# EAGLE design SensorController (EAGLE 6.1)
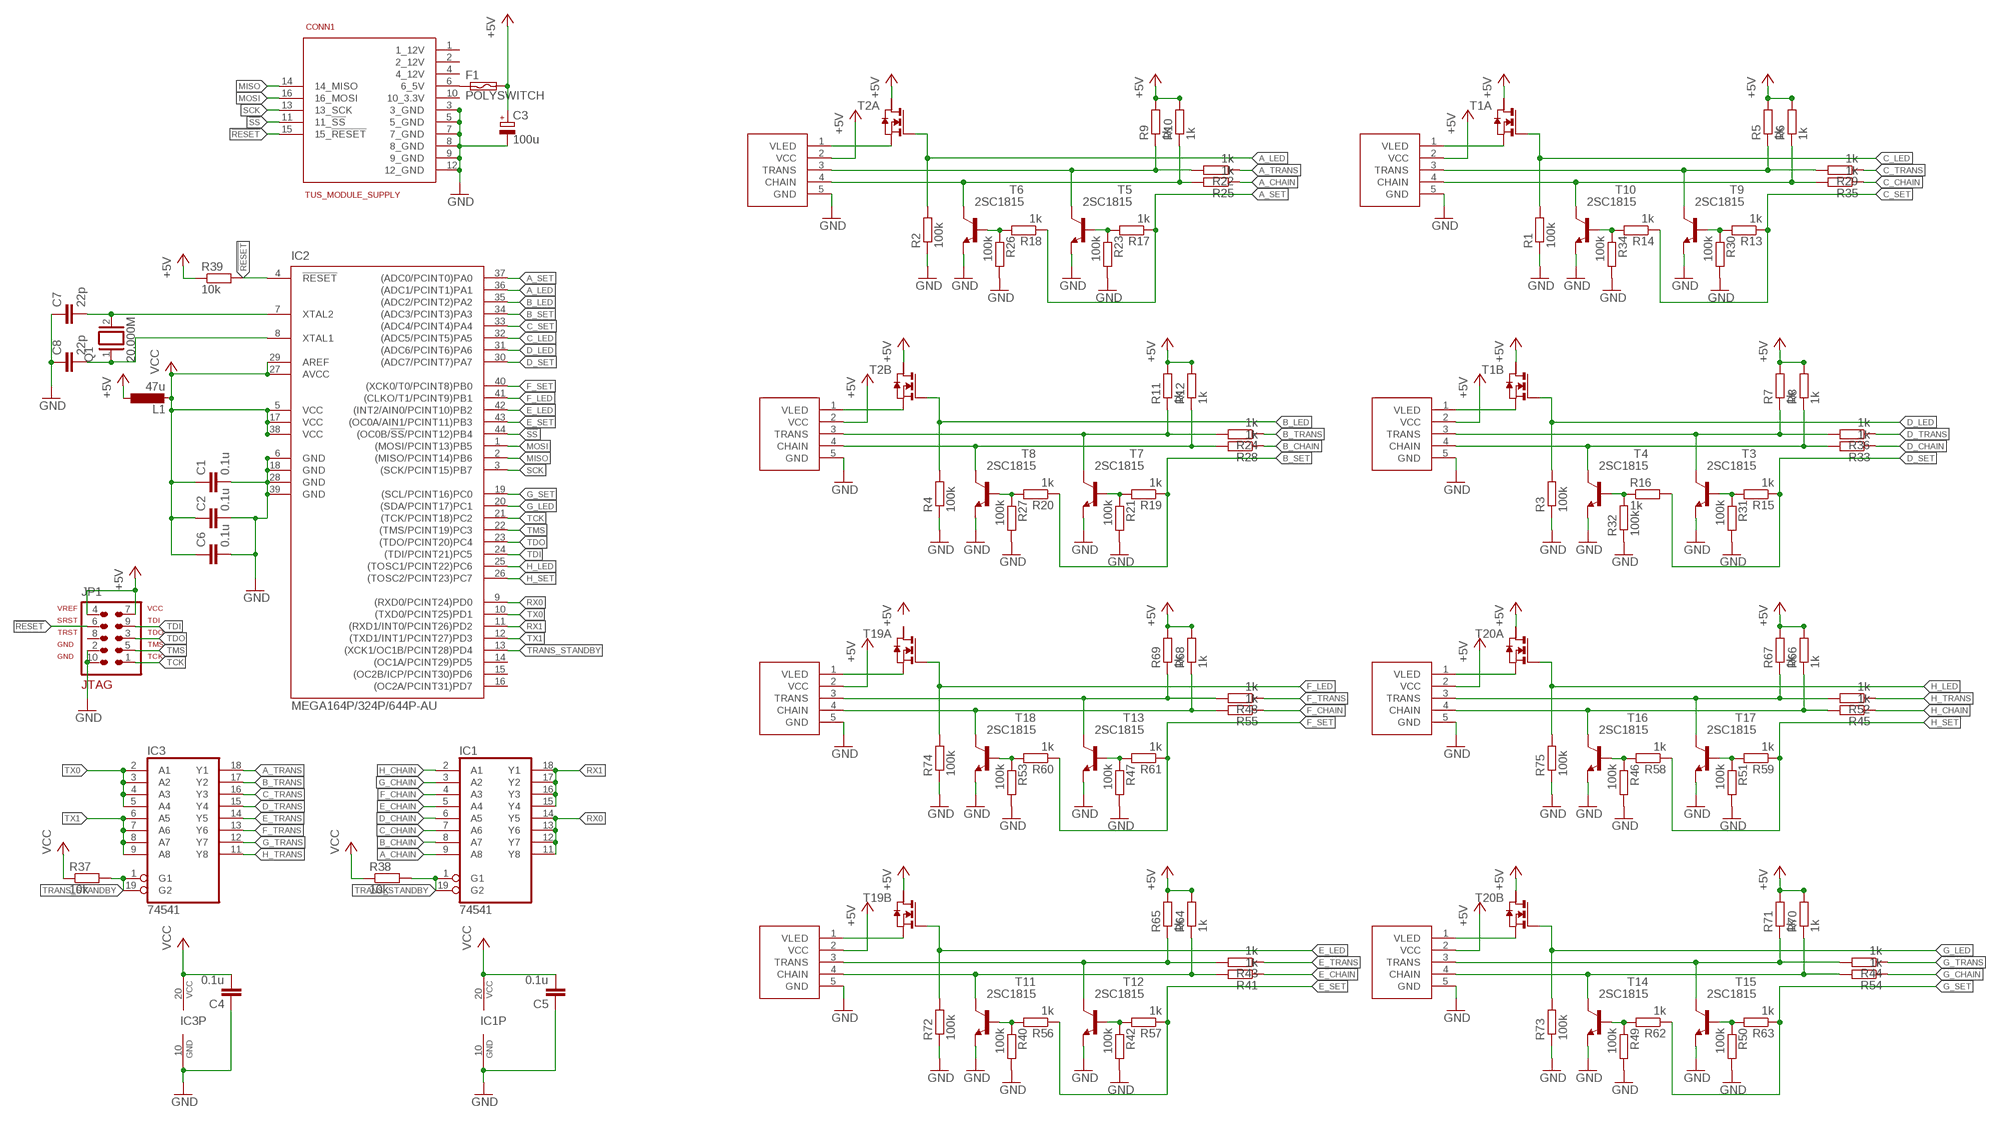
[diagram p0: schematic, sheet 1]

## Parts
A_OUT  SERIAL_SENSORXH  [XH-5]
B_OUT  SERIAL_SENSORXH  [XH-5]
C1  0.1u  C-EUC1608  [C1608]
C2  0.1u  C-EUC1608  [C1608]
C3  100u  CPOL-EUE2.5-7  [E2,5-7]
C4  0.1u  C-EUC1608  [C1608]
C5  0.1u  C-EUC1608  [C1608]
C6  0.1u  C-EUC1608  [C1608]
C7  22p  C-EUC1608  [C1608]
C8  22p  C-EUC1608  [C1608]
C_OUT  SERIAL_SENSORXH  [XH-5]
CONN1  TUS_MODULE_SUPPLY  [2X08]
D_OUT  SERIAL_SENSORXH  [XH-5]
E_OUT  SERIAL_SENSORXH  [XH-5]
F1  POLYSWITCH  [0207/2V]
F_OUT  SERIAL_SENSORXH  [XH-5]
G_OUT  SERIAL_SENSORXH  [XH-5]
H_OUT  SERIAL_SENSORXH  [XH-5]
IC1  74541  [SSOP20]
IC2  MEGA164P/324P/644P-AU  [TQFP44]
IC3  74541  [SSOP20]
JP1  AVR-JTAG-10  [AVR-JTAG-10]
L1  47u  L-EUL1812  [L1812]
Q1  20.000M  XTAL/S  [QS]
R1  100k  R-EU_R0603  [R0603]
R2  100k  R-EU_R0603  [R0603]
R3  100k  R-EU_R0603  [R0603]
R4  100k  R-EU_R0603  [R0603]
R5  1k  R-EU_R0603  [R0603]
R6  1k  R-EU_R0603  [R0603]
R7  1k  R-EU_R0603  [R0603]
R8  1k  R-EU_R0603  [R0603]
R9  1k  R-EU_R0603  [R0603]
R10  1k  R-EU_R0603  [R0603]
R11  1k  R-EU_R0603  [R0603]
R12  1k  R-EU_R0603  [R0603]
R13  1k  R-EU_R0603  [R0603]
R14  1k  R-EU_R0603  [R0603]
R15  1k  R-EU_R0603  [R0603]
R16  1k  R-EU_R0603  [R0603]
R17  1k  R-EU_R0603  [R0603]
R18  1k  R-EU_R0603  [R0603]
R19  1k  R-EU_R0603  [R0603]
R20  1k  R-EU_R0603  [R0603]
R21  100k  R-EU_R0603  [R0603]
R22  1k  R-EU_R0603  [R0603]
R23  100k  R-EU_R0603  [R0603]
R24  1k  R-EU_R0603  [R0603]
R25  1k  R-EU_R0603  [R0603]
R26  100k  R-EU_R0603  [R0603]
R27  100k  R-EU_R0603  [R0603]
R28  1k  R-EU_R0603  [R0603]
R29  1k  R-EU_R0603  [R0603]
R30  100k  R-EU_R0603  [R0603]
R31  100k  R-EU_R0603  [R0603]
R32  100k  R-EU_R0603  [R0603]
R33  1k  R-EU_R0603  [R0603]
R34  100k  R-EU_R0603  [R0603]
R35  1k  R-EU_R0603  [R0603]
R36  1k  R-EU_R0603  [R0603]
R37  10k  R-EU_R0603  [R0603]
R38  10k  R-EU_R0603  [R0603]
R39  10k  R-EU_R0603  [R0603]
R40  100k  R-EU_R0603  [R0603]
R41  1k  R-EU_R0603  [R0603]
R42  100k  R-EU_R0603  [R0603]
R43  1k  R-EU_R0603  [R0603]
R44  1k  R-EU_R0603  [R0603]
R45  1k  R-EU_R0603  [R0603]
R46  100k  R-EU_R0603  [R0603]
R47  100k  R-EU_R0603  [R0603]
R48  1k  R-EU_R0603  [R0603]
R49  100k  R-EU_R0603  [R0603]
R50  100k  R-EU_R0603  [R0603]
R51  100k  R-EU_R0603  [R0603]
R52  1k  R-EU_R0603  [R0603]
R53  100k  R-EU_R0603  [R0603]
R54  1k  R-EU_R0603  [R0603]
R55  1k  R-EU_R0603  [R0603]
R56  1k  R-EU_R0603  [R0603]
R57  1k  R-EU_R0603  [R0603]
R58  1k  R-EU_R0603  [R0603]
R59  1k  R-EU_R0603  [R0603]
R60  1k  R-EU_R0603  [R0603]
R61  1k  R-EU_R0603  [R0603]
R62  1k  R-EU_R0603  [R0603]
R63  1k  R-EU_R0603  [R0603]
R64  1k  R-EU_R0603  [R0603]
R65  1k  R-EU_R0603  [R0603]
R66  1k  R-EU_R0603  [R0603]
R67  1k  R-EU_R0603  [R0603]
R68  1k  R-EU_R0603  [R0603]
R69  1k  R-EU_R0603  [R0603]
R70  1k  R-EU_R0603  [R0603]
R71  1k  R-EU_R0603  [R0603]
R72  100k  R-EU_R0603  [R0603]
R73  100k  R-EU_R0603  [R0603]
R74  100k  R-EU_R0603  [R0603]
R75  100k  R-EU_R0603  [R0603]
T1  NMOS2SO8  [SO8]
T2  NMOS2SO8  [SO8]
T3  2SC1815  [TO92-ECB]
T4  2SC1815  [TO92-ECB]
T5  2SC1815  [TO92-ECB]
T6  2SC1815  [TO92-ECB]
T7  2SC1815  [TO92-ECB]
T8  2SC1815  [TO92-ECB]
T9  2SC1815  [TO92-ECB]
T10  2SC1815  [TO92-ECB]
T11  2SC1815  [TO92-ECB]
T12  2SC1815  [TO92-ECB]
T13  2SC1815  [TO92-ECB]
T14  2SC1815  [TO92-ECB]
T15  2SC1815  [TO92-ECB]
T16  2SC1815  [TO92-ECB]
T17  2SC1815  [TO92-ECB]
T18  2SC1815  [TO92-ECB]
T19  NMOS2SO8  [SO8]
T20  NMOS2SO8  [SO8]

## Nets
!RESET: CONN1.15(15_!RESET) IC2.4(!RESET) JP1.6 R39.2
!SS: CONN1.11(11_!SS) IC2.44((OC0B/!SS!/PCINT12)PB4)
+5V [+5v]: A_OUT.2(VCC) B_OUT.2(VCC) C3.+ C_OUT.2(VCC) D_OUT.2(VCC) E_OUT.2(VCC) F1.2 F_OUT.2(VCC) G_OUT.2(VCC) H_OUT.2(VCC) JP1.4 JP1.7 L1.1 R5.2 R6.2 R7.2 R8.2 R9.2 R10.2 R11.2 R12.2 R39.1 R64.2 R65.2 R66.2 R67.2 R68.2 R69.2 R70.2 R71.2 T1.6(B:D) T1.8(A:D) T2.6(B:D) T2.8(A:D) T19.6(B:D) T20.6(B:D) T20.8(A:D)
A_CHAIN: IC1.9(A8) R25.1
A_LED: IC2.36((ADC1/PCINT1)PA1) R2.2 T2.2(A:G)
A_SET: IC2.37((ADC0/PCINT0)PA0) R17.1 R18.1
A_TRANS: IC3.18(Y1) R22.1
B_CHAIN: IC1.8(A7) R28.1
B_LED: IC2.35((ADC2/PCINT2)PA2) R4.2 T2.4(B:G)
B_SET: IC2.34((ADC3/PCINT3)PA3) R19.1 R20.1
B_TRANS: IC3.17(Y2) R24.1
C_CHAIN: IC1.7(A6) R35.1
C_LED: IC2.32((ADC5/PCINT5)PA5) R1.2 T1.2(A:G)
C_SET: IC2.33((ADC4/PCINT4)PA4) R13.1 R14.1
C_TRANS: IC3.16(Y3) R29.1
D_CHAIN: IC1.6(A5) R33.1
D_LED: IC2.31((ADC6/PCINT6)PA6) R3.2 T1.4(B:G)
D_SET: IC2.30((ADC7/PCINT7)PA7) R15.1 R16.2
D_TRANS: IC3.15(Y4) R36.1
E_CHAIN: IC1.5(A4) R41.1
E_LED: IC2.42((INT2/AIN0/PCINT10)PB2) R72.2 T19.4(B:G)
E_SET: IC2.43((OC0A/AIN1/PCINT11)PB3) R56.1 R57.1
E_TRANS: IC3.14(Y5) R43.1
F_CHAIN: IC1.4(A3) R55.1
F_LED: IC2.41((CLKO/T1/PCINT9)PB1) R74.2 T19.2(A:G)
F_SET: IC2.40((XCK0/T0/PCINT8)PB0) R60.1 R61.1
F_TRANS: IC3.13(Y6) R48.1
G_CHAIN: IC1.3(A2) R54.1
G_LED: IC2.20((SDA/PCINT17)PC1) R73.2 T20.4(B:G)
G_SET: IC2.19((SCL/PCINT16)PC0) R62.1 R63.1
G_TRANS: IC3.12(Y7) R44.1
GND: A_OUT.5(GND) B_OUT.5(GND) C1.2 C2.2 C3.- C4.1 C5.1 C6.2 C7.1 C8.1 C_OUT.5(GND) CONN1.3(3_GND) CONN1.5(5_GND) CONN1.7(7_GND) CONN1.8(8_GND) CONN1.9(9_GND) CONN1.12(12_GND) D_OUT.5(GND) E_OUT.5(GND) F_OUT.5(GND) G_OUT.5(GND) H_OUT.5(GND) IC1.10(GND) IC2.6(GND) IC2.18(GND) IC2.28(GND) IC2.39(GND) IC3.10(GND) JP1.2 JP1.10 R1.1 R2.1 R3.1 R4.1 R21.2 R23.2 R26.2 R27.2 R30.2 R31.2 R32.1 R34.2 R40.2 R42.2 R46.2 R47.2 R49.2 R50.2 R51.2 R53.2 R72.1 R73.1 R74.1 R75.1 T3.E T4.E T5.E T6.E T7.E T8.E T9.E T10.E T11.E T12.E T13.E T14.E T15.E T16.E T17.E T18.E
H_CHAIN: IC1.2(A1) R45.1
H_LED: IC2.25((TOSC1/PCINT22)PC6) R75.2 T20.2(A:G)
H_SET: IC2.26((TOSC2/PCINT23)PC7) R58.1 R59.1
H_TRANS: IC3.11(Y8) R52.1
MISO: CONN1.14(14_MISO) IC2.2((MISO/PCINT14)PB6)
MOSI: CONN1.16(16_MOSI) IC2.1((MOSI/PCINT13)PB5)
N$1 [led]: A_OUT.1(VLED) T2.1(A:S)
N$2: C8.2 IC2.8(XTAL1) Q1.1
N$3: R17.2 R23.1 T5.B
N$4: C7.2 IC2.7(XTAL2) Q1.2
N$5: R18.2 R26.1 T6.B
N$6 [led]: B_OUT.1(VLED) T2.3(B:S)
N$7: R19.2 R21.1 T7.B
N$8: R20.2 R27.1 T8.B
N$9 [led]: F_OUT.1(VLED) T19.1(A:S)
N$10: R47.1 R61.2 T13.B
N$11: R53.1 R60.2 T18.B
N$12 [led]: E_OUT.1(VLED) T19.3(B:S)
N$13: R42.1 R57.2 T12.B
N$14: R40.1 R56.2 T11.B
N$15 [led]: C_OUT.1(VLED) T1.1(A:S)
N$16: R13.2 R30.1 T9.B
N$17: R14.2 R34.1 T10.B
N$18 [led]: D_OUT.1(VLED) T1.3(B:S)
N$19: R15.2 R31.1 T3.B
N$20: R16.1 R32.2 T4.B
N$21 [led]: H_OUT.1(VLED) T20.1(A:S)
N$22: R51.1 R59.2 T17.B
N$23: R46.1 R58.2 T16.B
N$24 [led]: G_OUT.1(VLED) T20.3(B:S)
N$25: R50.1 R63.2 T15.B
N$26: R49.1 R62.2 T14.B
N$27 [+5v]: CONN1.6(6_5V) F1.1
N$28: A_OUT.3(TRANS) R9.1 R22.2 T5.C
N$29: B_OUT.3(TRANS) R11.1 R24.2 T7.C
N$30: C_OUT.3(TRANS) R5.1 R29.2 T9.C
N$31: D_OUT.3(TRANS) R7.1 R36.2 T3.C
N$32: F_OUT.3(TRANS) R48.2 R69.1 T13.C
N$33: H_OUT.3(TRANS) R52.2 R67.1 T17.C
N$34: E_OUT.3(TRANS) R43.2 R65.1 T12.C
N$35: G_OUT.3(TRANS) R44.2 R71.1 T15.C
N$50: A_OUT.4(CHAIN) R10.1 R25.2 T6.C
N$51: B_OUT.4(CHAIN) R12.1 R28.2 T8.C
N$52: F_OUT.4(CHAIN) R55.2 R68.1 T18.C
N$53: E_OUT.4(CHAIN) R41.2 R64.1 T11.C
N$54: D_OUT.4(CHAIN) R8.1 R33.2 T4.C
N$55: C_OUT.4(CHAIN) R6.1 R35.2 T10.C
N$56: H_OUT.4(CHAIN) R45.2 R66.1 T16.C
N$60: G_OUT.4(CHAIN) R54.2 R70.1 T14.C
RX0: IC1.11(Y8) IC1.12(Y7) IC1.13(Y6) IC1.14(Y5) IC2.9((RXD0/PCINT24)PD0)
RX1: IC1.15(Y4) IC1.16(Y3) IC1.17(Y2) IC1.18(Y1) IC2.11((RXD1/INT0/PCINT26)PD2)
SCK: CONN1.13(13_SCK) IC2.3((SCK/PCINT15)PB7)
TCK: IC2.21((TCK/PCINT18)PC2) JP1.1
TDI: IC2.24((TDI/PCINT21)PC5) JP1.9
TDO: IC2.23((TDO/PCINT20)PC4) JP1.3
TMS: IC2.22((TMS/PCINT19)PC3) JP1.5
TRANS_STANDBY: IC1.1(G1) IC1.19(G2) IC2.13((XCK1/OC1B/PCINT28)PD4) IC3.1(G1) IC3.19(G2) R37.2 R38.2
TX0: IC2.10((TXD0/PCINT25)PD1) IC3.2(A1) IC3.3(A2) IC3.4(A3) IC3.5(A4)
TX1: IC2.12((TXD1/INT1/PCINT27)PD3) IC3.6(A5) IC3.7(A6) IC3.8(A7) IC3.9(A8)
VCC: C1.1 C2.1 C4.2 C5.2 C6.1 IC1.20(VCC) IC2.5(VCC) IC2.17(VCC) IC2.27(AVCC) IC2.29(AREF) IC2.38(VCC) IC3.20(VCC) L1.2 R37.1 R38.1
Unconnected: CONN1.1(1_12V) CONN1.2(2_12V) CONN1.4(4_12V) CONN1.10(10_3.3V) IC2.14((OC1A/PCINT29)PD5) IC2.15((OC2B/ICP/PCINT30)PD6) IC2.16((OC2A/PCINT31)PD7) JP1.8 T1.5(B:D2) T1.7(A:D2) T2.5(B:D2) T2.7(A:D2) T19.5(B:D2) T19.7(A:D2) T19.8(A:D) T20.5(B:D2) T20.7(A:D2)

## Library data of the parts
A_OUT B_OUT C_OUT D_OUT E_OUT F_OUT G_OUT H_OUT = myparts:SERIAL_SENSOR
C1 C2 C4-C8 = rcl:C-EU: CAPACITOR, European symbol
C3 = rcl:CPOL-EU: POLARIZED CAPACITOR, European symbol
CONN1 = tus:TUS_MODULE_SUPPLY
F1 = myparts:POLYSWITCH
IC1 IC3 = myparts:74*541: Octal BUFFER and LINE DRIVER, 3-state
IC2 = avr-7:MEGA164P/324P/644P-AU
JP1 = avr-7:AVR-JTAG-10: AVR JTAG Debug/Programming Header
L1 = resistor:L-EU: INDUCTOR, European symbol
Q1 = special:XTAL/S: CRYSTAL
R1-R13 R15-R33 R35-R75 = rcl:R-EU_: RESISTOR, European symbol
R14 R34 = resistor:R-EU_: RESISTOR, European symbol
T1 T2 T19 T20 = zetex:NMOS2: Dual MOS FET; OC_FARNELL: unknown; OC_NEWARK: unknown
T3-T18 = myparts:2SC1815: NPN EPITAXIAL TRANSISTOR Source: TOSHIBA .. 2SC1815 1.pdf

## Net classes
1 +5v: width 0.762 mm
2 led: width 0.508 mm

## Board
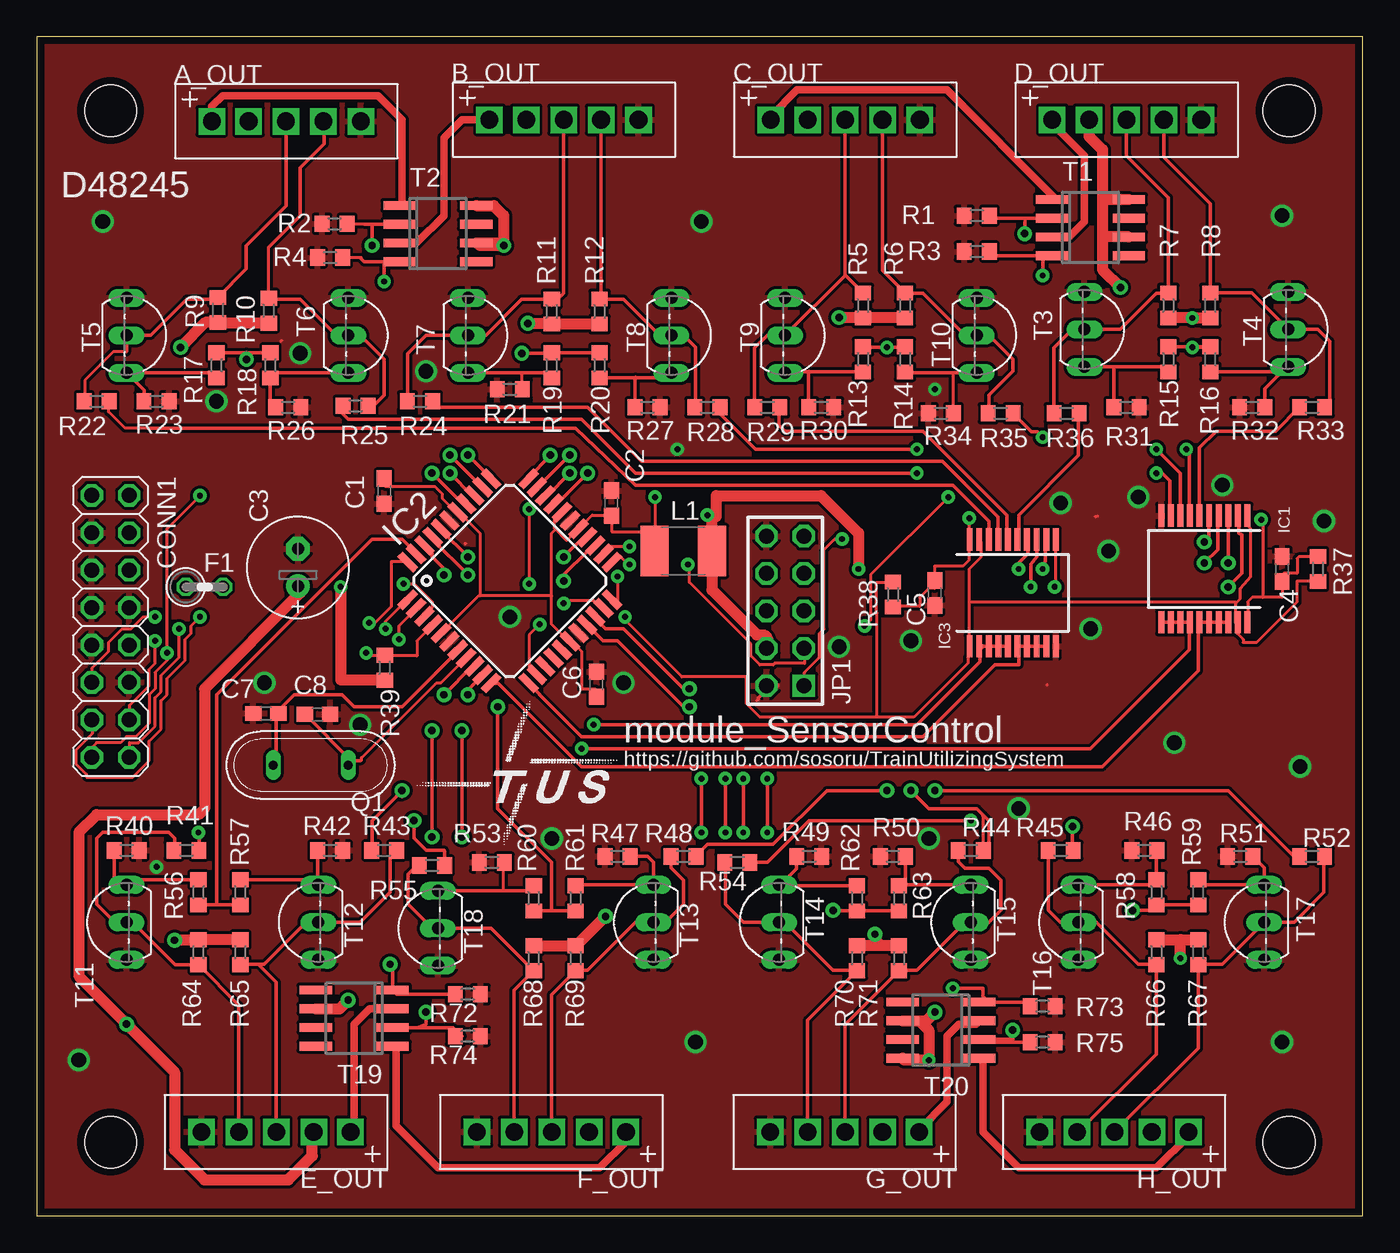
[diagram p1: board, top side]
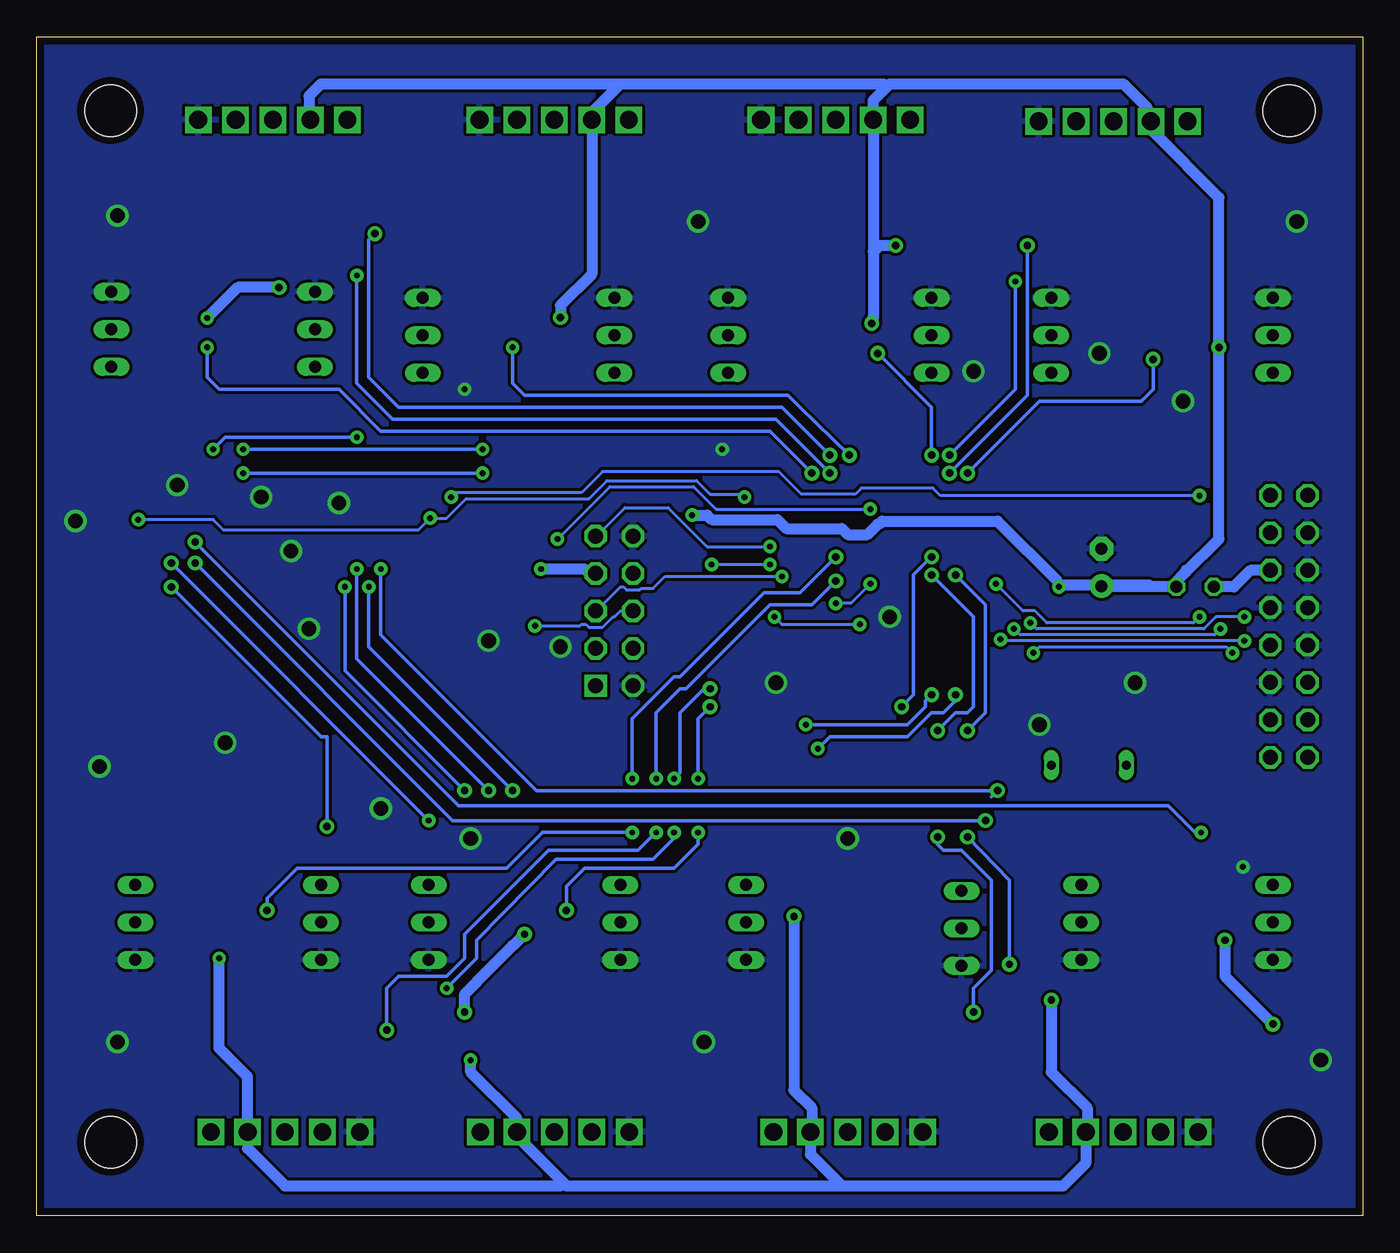
[diagram p2: board, bottom side, seen from below]

Size 90 x 80 mm. Coordinates in mm from the lower left corner, seen from the top.
Outline: 0,0 90,0 90,80 0,80 0,0
Copper layers (1*16): Top 0.035mm / dielectric 1.5mm / Bottom 0.035mm
Design rules: minimum track width 8mil, minimum drill 0.4mm, track to track 8mil, track to pad 8mil, pad to pad 8mil, via to via 8mil, smd to smd 8mil, copper to edge 20mil, drill to drill 8mil, minimum pad ring 8mil, minimum via ring 10mil, stop-mask expansion 3mil, vias tented up to drill 0mil, thermal gap 8mil
Holes 3.5 mm at 5,5 5,75 85,75 85,5

### Footprints (pad centres in the part's own frame; a part is rotated, then mirrored left to right if it is on the bottom)
XH-5 = drill 1.2 square: 1 -5.04,0; 2 -2.54,0; 3 0,0; 4 2.54,0; 5 5.08,0
C1608 = smd 1.1 x 1: 1 -0.85,0; 2 0.85,0
E2,5-7 = drill 0.813 pad 1.6: + -1.27,0 | drill 0.813 pad 1.6 octagon: - 1.27,0
2X08 = drill 1.016 octagon: 1 -8.89,-1.27; 2 -8.89,1.27; 3 -6.35,-1.27; 4 -6.35,1.27; 5 -3.81,-1.27; 6 -3.81,1.27; 7 -1.27,-1.27; 8 -1.27,1.27; 9 1.27,-1.27; 10 1.27,1.27; 11 3.81,-1.27; 12 3.81,1.27; 13 6.35,-1.27; 14 6.35,1.27; 15 8.89,-1.27; 16 8.89,1.27
0207/2V = drill 0.813 octagon: 1 -1.27,0; 2 1.27,0
SSOP20 = smd 0.4 x 1.5: 1 -2.925,-3.625; 2 -2.275,-3.625; 3 -1.625,-3.625; 4 -0.975,-3.625; 5 -0.325,-3.625; 6 0.325,-3.625; 7 0.975,-3.625; 8 1.625,-3.625; 9 2.275,-3.625; 10 2.925,-3.625; 11 2.925,3.625; 12 2.275,3.625; 13 1.625,3.625; 14 0.975,3.625; 15 0.325,3.625; 16 -0.325,3.625; 17 -0.975,3.625; 18 -1.625,3.625; 19 -2.275,3.625; 20 -2.925,3.625
TQFP44 = smd 1.5 x 0.5: 1 -5.8,4; 2 -5.8,3.2; 3 -5.8,2.4; 4 -5.8,1.6; 5 -5.8,0.8; 6 -5.8,0; 7 -5.8,-0.8; 8 -5.8,-1.6; 9 -5.8,-2.4; 10 -5.8,-3.2; 11 -5.8,-4; 23 5.8,-4; 24 5.8,-3.2; 25 5.8,-2.4; 26 5.8,-1.6; 27 5.8,-0.8; 28 5.8,0; 29 5.8,0.8; 30 5.8,1.6; 31 5.8,2.4; 32 5.8,3.2; 33 5.8,4 | smd 0.5 x 1.5: 12 -4,-5.8; 13 -3.2,-5.8; 14 -2.4,-5.8; 15 -1.6,-5.8; 16 -0.8,-5.8; 17 0,-5.8; 18 0.8,-5.8; 19 1.6,-5.8; 20 2.4,-5.8; 21 3.2,-5.8; 22 4,-5.8; 34 4,5.8; 35 3.2,5.8; 36 2.4,5.8; 37 1.6,5.8; 38 0.8,5.8; 39 0,5.8; 40 -0.8,5.8; 41 -1.6,5.8; 42 -2.4,5.8; 43 -3.2,5.8; 44 -4,5.8
AVR-JTAG-10 = drill 1.016 square: 1 -5.08,-1.27 | drill 1.016 octagon: 2 -5.08,1.27; 3 -2.54,-1.27; 4 -2.54,1.27; 5 0,-1.27; 6 0,1.27; 7 2.54,-1.27; 8 2.54,1.27; 9 5.08,-1.27; 10 5.08,1.27
L1812 = smd 1.9 x 3.4: 1 -1.95,0; 2 1.95,0
QS = drill 0.61 long: 1 -2.54,0; 2 2.54,0
R0603 = smd 1 x 1.1: 1 -0.85,0; 2 0.85,0
SO8 = smd 0.6 x 2.2: 1 -1.905,-2.6; 2 -0.635,-2.6; 3 0.635,-2.6; 4 1.905,-2.6; 5 1.905,2.6; 6 0.635,2.6; 7 -0.635,2.6; 8 -1.905,2.6
TO92-ECB = drill 0.813 long: B 2.54,0; C 0,0; E -2.54,0

### Placement (x,y rotation side)
A_OUT  16.92,74.27 0 top
B_OUT  35.76,74.37 0 top
C1  23.57,49.17 270 top
C2  39.01,48.36 90 top
C3  17.73,43.99 90 top
C4  84.53,43.89 270 top
C5  60.96,42.27 90 top
C6  38,36.07 90 top
C7  15.54,34.09 0 top
C8  19.05,34.04 180 top
C_OUT  54.86,74.37 0 top
CONN1  5,40 270 top
D_OUT  73.96,74.37 0 top
E_OUT  16.26,5.69 180 top
F1  11.38,42.67 0 top
F_OUT  34.95,5.69 180 top
G_OUT  54.86,5.69 180 top
H_OUT  73.15,5.69 180 top
IC1  79.25,43.89 180 top
IC2  32.11,43.08 45 top
IC3  66.24,42.27 0 top
JP1  50.8,41.05 90 top
L1  43.89,45.11 180 top
Q1  18.59,30.58 180 top
R1  63.8,67.87 0 top
R2  20.22,67.31 0 top
R3  63.8,65.43 0 top
R4  19.91,65.02 0 top
R5  56.08,61.77 270 top
R6  58.93,61.77 270 top
R7  76.81,61.77 270 top
R8  79.65,61.77 270 top
R9  12.29,61.47 270 top
R10  15.75,61.42 270 top
R11  34.95,61.37 270 top
R12  38.2,61.37 270 top
R13  56.08,58.12 270 top
R14  58.93,58.12 270 top
R15  76.81,58.12 270 top
R16  79.65,58.12 90 top
R17  12.19,57.71 270 top
R18  15.85,57.71 270 top
R19  34.95,57.71 270 top
R20  38.2,57.71 270 top
R21  32.11,56.08 180 top
R22  4.06,55.27 180 top
R23  8.13,55.27 0 top
R24  26.01,55.27 180 top
R25  21.64,54.97 0 top
R26  17.07,54.86 0 top
R27  41.45,54.86 0 top
R28  45.52,54.86 180 top
R29  49.58,54.86 180 top
R30  53.24,54.86 0 top
R31  73.96,54.86 0 top
R32  82.5,54.86 0 top
R33  86.56,54.86 0 top
R34  61.37,54.46 180 top
R35  65.43,54.46 180 top
R36  69.9,54.46 180 top
R37  86.97,43.89 270 top
R38  58.12,42.16 90 top
R39  23.62,37.19 90 top
R40  6.1,24.79 0 top
R41  10.16,24.79 180 top
R42  19.91,24.79 0 top
R43  23.57,24.79 0 top
R44  63.4,24.79 180 top
R45  69.49,24.79 180 top
R46  75.18,24.79 180 top
R47  39.42,24.38 180 top
R48  43.89,24.38 180 top
R49  52.43,24.38 0 top
R50  58.12,24.38 180 top
R51  81.69,24.38 180 top
R52  86.56,24.38 0 top
R53  30.89,23.98 180 top
R54  47.55,23.98 180 top
R55  26.82,23.77 180 top
R56  10.97,21.95 90 top
R57  13.82,21.95 90 top
R58  76,21.95 90 top
R59  78.84,21.95 90 top
R60  33.73,21.54 90 top
R61  36.58,21.54 90 top
R62  55.68,21.54 90 top
R63  58.52,21.54 90 top
R64  10.97,17.88 90 top
R65  13.82,17.88 90 top
R66  76,17.88 90 top
R67  78.84,17.88 90 top
R68  33.73,17.48 90 top
R69  36.58,17.48 90 top
R70  55.68,17.48 90 top
R71  58.52,17.48 90 top
R72  29.26,15.04 180 top
R73  68.28,14.22 180 top
R74  29.26,12.19 180 top
R75  68.28,11.79 180 top
T1  71.53,67.06 270 top
T2  27.23,66.65 270 top
T3  71.12,60.15 270 top
T4  84.94,60.15 270 top
T5  6.1,59.74 270 top
T6  21.13,59.74 270 top
T7  29.26,59.74 270 top
T8  43.08,59.74 270 top
T9  50.8,59.74 270 top
T10  63.8,59.74 270 top
T11  6.1,19.91 90 top
T12  19.1,19.91 90 top
T13  41.86,19.91 90 top
T14  50.39,19.91 90 top
T15  63.4,19.91 90 top
T16  70.71,19.91 90 top
T17  83.31,19.91 90 top
T18  27.23,19.51 90 top
T19  21.54,13.41 90 top
T20  61.37,12.6 90 top

### Tracks (layer width: path | path; a pad name or v marks a point on that pad's centre or on a via)
!RESET  (via drill 0.4)
  Top 0.203: IC2.4 26.82,40.03 25.81,39.01 25.81,38 23.67,38 R39.2 23.57,38 22.45,38 22.35,38.1 v22.35,38.2 | v56.19,40.03 56.59,40.44 56.59,43.48 v61.87,48.77 | v11.07,48.87 8.84,46.63 v8.84,38.2 8.84,37.69 8.03,36.88 8.03,35.76 7.62,35.36 7.62,33.43 6.71,32.51 6.1,32.51 5.69,32.11 4.06,32.11 3.76,31.8 3.76,31.19 CONN1.15
  Bottom 0.203: v8.84,38.2 9.25,38.61 21.95,38.61 v22.35,38.2 | JP1.6 50.39,41.05 50.8,40.64 50.9,40.64 51.61,39.93 52.53,39.93 52.73,40.13 53.03,40.13 53.14,40.03 v56.19,40.03 | v61.87,48.77 61.57,49.07 53.03,49.07 51.61,50.49 39.62,50.49 38.1,48.97 34.44,48.97 34.04,49.38 29.16,49.38 28.65,48.87 v11.07,48.87
!SS  (via drill 0.4)
  Top 0.203: v22.55,40.23 22.96,40.23 24.08,41.35 24.08,44.4 25.09,44.4 IC2.44 | v8.03,40.64 7.21,40.64 6.4,39.83 5.79,39.83 4.88,38.91 4.88,38.3 3.76,37.19 3.76,36.27 CONN1.11
  Bottom 0.203: v22.55,40.23 22.15,39.83 10.77,39.83 9.96,40.64 v8.03,40.64
+5V  (via drill 0.4, 0.5)
  Top 0.762: v54.46,60.96 56.08,60.96 | 56.08,60.96 58.93,60.96 R6.2 | R8.2 v78.44,60.92 R7.2 | v9.75,58.93 11.44,60.62 R9.2 12.19,60.55 12.21,60.57 R10.2 | v33.33,60.55 34.58,60.55 R11.2 38.16,60.52 38.2,60.55 R12.2 | T2.8 31.01,68.56 31.7,67.87 31.7,66.24 31.47,66.02 | 31.47,66.02 v31.7,65.84 30.07,65.84 | T2.6 31.47,66.02 | 10.97,18.69 v9.35,18.69 | T19.6 20.55,14.05 v21.13,14.63 | v38.61,20.32 36.61,18.32 R69.2 36.27,18.39 36.27,18.32 | T20.8 58.89,10.57 v60.55,10.57 60.55,12.6 59.92,13.23 T20.6 60.38,13.23 v60.96,13.82 | R71.2 57.3,18.32 | 57.3,18.32 R70.2 | v56.9,19.1 56.9,18.73 57.3,18.32 | D_OUT.2 71.42,73.25 72.34,72.34 72.34,68.68 | 72.34,68.68 72.34,66.24 | 72.34,66.24 72.34,64.21 v73.56,62.99 | T1.6 72.52,66.42 72.34,66.24 | T1.8 72.62,68.96 72.34,68.68 | v20.62,42.67 20.62,36.37 23.57,36.37 R39.1 | JP1.4 49.58,38.51 49.58,39.22 49.38,39.42 48.87,39.42 45.82,42.47 45.82,45.11 L1.1 45.82,45.41 45.82,47.24 | 45.82,47.24 v45.52,47.55 | R68.2 36.27,18.32 | 36.27,18.32 36.54,18.32 36.58,18.29 | R66.2 77.62,18.73 | 77.62,18.73 R67.2 | v77.62,17.48 77.62,18.73 | R65.2 11.01,18.73 10.97,18.69 | 10.97,18.69 R64.2 | 56.08,60.96 R5.2 | E_OUT.2 18.69,5.59 18.69,4.06 17.07,2.44 11.38,2.44 9.35,4.47 9.35,9.75 v6.1,13.01 2.85,16.26 2.85,26.01 4.06,27.23 10.97,27.23 11.38,27.64 11.38,35.76 17.88,42.27 17.88,42.57 C3.+ | v55.78,43.89 55.78,46.33 53.24,48.87 46.13,48.87 46.13,47.45 45.82,47.24
  Bottom 0.762: 12.85,42.82 12.95,42.72 C3.+ 14.43,42.77 20.52,42.77 v20.62,42.67 20.73,43.08 24.79,47.14 32.61,47.14 32.82,46.94 32.92,46.94 33.63,46.23 34.95,46.23 35.36,46.63 39.12,46.63 39.73,47.24 44.2,47.24 44.5,47.55 v45.52,47.55 | 12.85,42.82 11.99,43.69 | 11.99,43.69 9.75,45.92 v9.75,58.93 9.75,69.09 14.22,73.56 14.22,74.12 A_OUT.2 14.63,74.52 14.63,75.18 16.26,76.81 32.11,76.81 32.31,76.61 | 32.31,76.61 33.22,75.69 B_OUT.2 33.22,65.43 | 50.39,76.81 52.32,74.88 C_OUT.2 52.32,63.91 54.46,61.77 v54.46,60.96 | 50.39,76.81 32.51,76.81 32.31,76.61 | 71.42,74.47 D_OUT.2 71.53,74.37 71.53,76 70.71,76.81 50.39,76.81 | 33.22,65.43 33.22,61.06 v33.33,60.55 | v31.7,65.84 32.82,65.84 33.22,65.43 | 35.36,2.03 37.49,4.17 F_OUT.2 37.39,5.79 37.39,7.32 38.61,8.53 v38.61,20.32 | 35.36,2.03 20.32,2.03 18.8,3.56 E_OUT.2 18.69,5.79 18.69,7.32 21.13,9.75 v21.13,14.63 | 54.25,2.23 57.4,5.38 G_OUT.2 57.4,6.6 60.55,9.75 v60.55,10.57 | 54.25,2.23 54.05,2.03 35.36,2.03 | 54.25,2.23 54.46,2.03 73.15,2.03 75.69,4.57 H_OUT.2 75.69,9.45 77.62,11.38 v77.62,17.48 | v9.35,18.69 9.35,16.26 v6.1,13.01 | v60.96,13.82 60.96,15.04 60.15,15.85 60.15,15.89 57.71,18.32 57.67,18.32 v56.9,19.1 | v73.56,62.99 76.37,62.99 v78.44,60.92 | 11.99,43.81 11.99,43.69 | JP1.7 52.53,43.59 52.83,43.89 v55.78,43.89 | F1.2 12.7,42.67 12.85,42.82
A_CHAIN  (via drill 0.4)
  Top 0.203: R25.1 20.73,54.97 20.73,54.86
  Top 0.254: v59.74,50.39 40.64,50.39 36.98,54.05 21.13,54.05 20.73,54.46 20.73,54.86 | v76,50.39 76.4,50.39 76.91,49.89 76.91,47.58 IC1.9
  Bottom 0.254: v59.74,50.39 v76,50.39
A_LED  (via drill 0.5)
  Top 0.203: 22.86,67.28 22.86,67.26 22.76,67.26
  Top 0.254: IC2.36 29.56,48.88 v28.04,50.39 | v22.76,65.84 22.76,67.26 | T2.2 22.86,67.28 22.26,67.28 R2.2
  Bottom 0.254: v28.04,50.39 22.76,55.68 v22.76,65.84
A_SET  (via drill 0.5)
  Top 0.203: 14.22,58.62 14.22,58.56 14.22,58.52
  Top 0.254: R17.1 14.22,58.56 R18.1 | IC2.37 28.91,48.31 v26.82,50.39 | v14.22,58.12 14.22,58.52
  Bottom 0.254: v26.82,50.39 21.95,55.27 15.04,55.27 14.22,56.08 v14.22,58.12
A_TRANS
  Top 0.203: 7.52,53.44 5.99,53.44 4.88,54.56 4.88,55.27 R22.1 | 64.62,45.92 IC3.18
  Top 0.254: 7.52,53.44 36.58,53.44 40.64,49.58 62.18,49.58 64.62,47.14 64.62,45.92
B_CHAIN  (via drill 0.4)
  Top 0.203: 46.43,54.86 R28.1 46.33,54.86
  Top 0.254: v59.74,52.02 48.77,52.02 46.33,54.46 46.33,54.86 | v76,52.02 77.62,50.39 IC1.8
  Bottom 0.254: v59.74,52.02 v76,52.02
B_LED  (via drill 0.4, 0.5)
  Top 0.203: R4.2 22.05,65.02 22,64.97 | T2.4 23.57,64.72 23.57,64.62
  Top 0.254: T2.4 22.23,64.75 22,64.97 21.95,65.02 | IC2.35 30.21,49.44 v28.04,51.61 | v23.57,63.4 23.57,64.62
  Bottom 0.254: v28.04,51.61 23.57,56.08 v23.57,63.4
B_SET  (via drill 0.5)
  Top 0.203: 34.95,58.52 R19.1
  Top 0.254: R20.1 R19.1 | IC2.34 30.83,50.04 v29.26,51.61 | v32.92,58.52 34.95,58.52
  Bottom 0.254: v29.26,51.61 29.26,54.86 v32.92,58.52
B_TRANS
  Top 0.203: 65.33,46.33 65.33,45.92 IC3.17 65.33,46.33 | 65.33,46.33 65.23,46.43 65.23,46.53 | 26.82,54.86 26.82,55.27 R24.1
  Top 0.254: 65.23,46.53 65.23,47.45 61.47,51.21 41.05,51.21 37.39,54.86 26.82,54.86
C_CHAIN  (via drill 0.4)
  Top 0.254: v68.28,52.83 67.91,53.2 67.5,53.2 66.28,54.42 R35.1 | v78.03,52.02 78.23,51.82 78.23,47.56 IC1.7
  Bottom 0.254: v68.28,52.83 77.22,52.83 v78.03,52.02
C_LED  (via drill 0.5)
  Top 0.203: 67.06,67.69 67.06,67.46
  Top 0.254: IC2.32 34,49.44 v36.17,51.61 | T1.2 67.06,67.69 64.83,67.69 R1.2 | v67.06,66.65 67.06,67.46
  Bottom 0.254: v67.06,66.65 67.46,66.24 67.46,56.9 65.43,54.86 39.42,54.86 v36.17,51.61
C_SET  (via drill 0.4, 0.5)
  Top 0.254: IC2.33 33.38,50.04 v34.85,51.61 | R14.1 58.89,58.93 v57.71,58.93 56.12,58.93 R13.1
  Bottom 0.254: v34.85,51.61 38.2,54.86 39.01,55.68 56.9,55.68 57.71,56.49 v57.71,58.93
C_TRANS
  Top 0.203: 50.49,54.86 R29.1 50.39,54.86
  Top 0.254: IC3.16 65.84,45.97 65.84,47.55 60.15,53.24 50.8,53.24 50.39,53.65 50.39,54.86
D_CHAIN
  Top 0.254: IC1.6 78.92,52.1 80.06,53.24 84.09,53.24 R33.1
D_LED  (via drill 0.4, 0.5)
  Top 0.254: T1.4 68.28,65.15 | 68.28,65.15 64.93,65.15 R3.2 | IC2.31 34.65,48.88 v36.17,50.39 | v68.28,63.8 68.28,65.15
  Bottom 0.254: v68.28,63.8 68.28,56.49 65.84,54.05 39.83,54.05 v36.17,50.39
D_SET  (via drill 0.4, 0.5)
  Top 0.203: 79.65,58.93 R16.2
  Top 0.254: IC2.30 35.31,48.31 v37.39,50.39 | v78.44,58.93 79.65,58.93 | R16.2 R15.1
  Bottom 0.254: v78.44,58.93 78.44,56.9 77.62,56.08 69.49,56.08 66.65,53.24 40.23,53.24 v37.39,50.39
D_TRANS
  Top 0.203: 66.65,45.92 IC3.15 | 70.81,54.46 R36.1 70.71,54.46
  Top 0.254: 66.65,45.92 66.65,47.55 70.71,51.61 70.71,54.46
E_CHAIN  (via drill 0.4, 0.5)
  Top 0.254: R41.1 11.01,25.97 v10.97,26.01 | v79.25,45.72 79.25,45.82 79.55,46.13 79.55,47.5 IC1.5
  Bottom 0.254: v10.97,26.01 11.38,26.01 13.21,27.84 61.37,27.84 v79.25,45.72
E_LED  (via drill 0.5)
  Top 0.254: R72.2 24.42,15.04 T19.4 24.14,16.91 v23.98,17.07 | v26.82,25.7 v26.82,32.92 | v27.64,43.48 27.64,43.89 26.82,44.7 26.82,44.97 IC2.42
  Bottom 0.254: v23.98,17.07 23.98,22.76 v26.82,25.7 | v26.82,32.92 25.6,34.14 25.6,41.45 v27.64,43.48
E_SET
  Top 0.254: R56.1 12.19,21.1 | 12.19,21.1 R57.1 | IC2.43 25.74,44.97 24.79,45.92 22.76,45.92 12.19,35.36 12.19,21.1
E_TRANS  (via drill 0.4, 0.5)
  Top 0.203: 22.76,24.79 R43.1
  Top 0.254: 24.79,28.45 v24.79,28.85 22.76,26.82 22.76,24.79 | v66.65,43.89 66.65,44.3 67.26,44.91 67.26,45.85 IC3.14
  Bottom 0.254: 25.2,28.45 v24.79,28.85 56.08,28.85 66.65,39.42 v66.65,43.89
F_CHAIN  (via drill 0.5)
  Top 0.203: IC1.4 80.26,47.45 80.26,47.35
  Top 0.254: R55.1 27.67,24.75 27.64,24.79 26.42,24.79 25.6,25.6 v25.6,26.82 | v79.25,44.3 80.16,45.21 80.16,47.24 80.26,47.35
  Bottom 0.254: v25.6,26.82 61.77,26.82 v79.25,44.3
F_LED  (via drill 0.5)
  Top 0.203: R74.2 28.45,12.19 28.45,12.5 28.5,12.55
  Top 0.254: 28.85,12.19 28.5,12.55 28.27,12.78 T19.2 25.83,12.78 26.42,13.01 v26.42,13.82 | IC2.41 26.87,45.87 v29.26,43.48 | v28.85,32.92 v28.85,25.7
  Bottom 0.203: v28.85,25.7 28.85,25.6
  Bottom 0.254: v29.26,43.48 26.42,40.64 26.42,34.54 26.82,34.14 27.64,34.14 v28.85,32.92 | v26.42,13.82 26.42,15.44 25.2,16.66 25.2,22.76 27.23,24.79 28.45,24.79 28.85,25.2 28.85,25.6
F_SET  (via drill 0.5)
  Top 0.254: R60.1 34.95,20.69 | 34.95,20.69 R61.1 | IC2.40 27.44,46.53 v29.26,44.7 | v31.29,34.54 31.29,27.64 34.95,23.98 34.95,20.69
  Bottom 0.254: v29.26,44.7 30.48,43.48 30.48,35.36 v31.29,34.54
F_TRANS  (via drill 0.4, 0.5)
  Top 0.203: R48.1 44.81,24.38 44.76,24.43
  Top 0.254: v57.71,28.85 53.65,28.85 49.99,25.2 45.52,25.2 44.76,24.43 44.7,24.38 | v67.46,42.67 67.46,44.2 67.87,44.7 IC3.13
  Bottom 0.254: v57.71,28.85 67.46,38.61 v67.46,42.67
G_CHAIN  (via drill 0.4, 0.5)
  Top 0.254: R54.1 49.58,23.98 52.43,26.82 v63.4,26.82 | v80.87,44.3 IC1.3
  Bottom 0.254: v63.4,26.82 v80.87,44.3
G_LED  (via drill 0.4, 0.5)
  Top 0.203: 67.46,14.22 R73.2 | 64.21,14.91 64.21,15.04
  Top 0.254: T20.4 64.62,14.5 | 64.62,14.5 67.18,14.5 67.46,14.22 | IC2.20 37.9,40.53 38.61,39.83 39.83,39.83 43.89,35.76 v44.3,35.76 | v46.74,29.67 v46.74,26.01 | 64.21,14.91 64.62,14.5 | v62.18,15.44 64.21,15.44 64.21,15.04
  Bottom 0.254: v44.3,35.76 44.7,35.76 46.33,34.14 46.33,30.07 v46.74,29.67 | v46.74,26.01 46.74,25.6 48.16,24.18 54.76,24.18 60.15,18.69 60.15,17.48 v62.18,15.44
G_SET  (via drill 0.4, 0.5)
  Top 0.254: R63.1 R62.1 54.09,20.69 v54.05,20.73 | v45.11,26.01 v45.11,29.67 | v44.3,34.54 43.89,34.54 39.42,39.01 38.43,39.01 IC2.19
  Bottom 0.254: v54.05,20.73 54.05,22.35 52.83,23.57 46.74,23.57 45.11,25.2 v45.11,26.01 | v45.11,29.67 45.11,33.73 v44.3,34.54
G_TRANS  (via drill 0.4, 0.5)
  Top 0.203: R44.1 64.21,24.79 64.21,27.13 64.26,27.18
  Top 0.254: v59.33,28.85 60.55,27.64 63.8,27.64 64.26,27.18 64.62,26.82 64.62,24.79 | v68.28,43.89 68.28,44.2 68.48,44.4 68.48,45.85 IC3.12
  Bottom 0.254: v59.33,28.85 68.28,37.8 v68.28,43.89
GND  (via drill 0.4, 1)
  Top 0.203: 68.58,36.07 68.58,36.02 | 29.06,45.62 29.11,45.61 | 28.04,47.14 IC2.39 | 48.97,35.05 48.88,34.96 | 50.29,36.07 50.29,35.92 | 71.83,47.45 72.01,47.5 | 16.56,59.33 16.63,59.4
  Top 0.254: 48.97,35.05 48.97,35.15 49.58,35.76
  other vias: 74.78,48.77 77.22,32.11 87.38,47.14 32.11,40.64 39.83,36.17 15.44,36.17 21.95,33.32 54.46,38.61 12.19,55.27 34.95,25.6 60.55,25.6 66.65,27.64 44.7,11.79 84.53,11.79 85.75,30.48 45.11,67.46 4.47,67.46 84.53,67.87 2.84,10.57 59.33,39.01 71.53,39.83 72.75,45.11 8.13,23.67 26.42,57.3 17.88,58.52 43.48,52.02 60.96,56.08 80.47,49.58 69.49,48.36
  pour Bottom: -1.27,81.28 -1.27,-1.27 92.71,-1.27 92.71,81.28
  pour Top: -2.54,82.55 -2.54,-3.81 95.25,-3.81 95.25,82.55
H_CHAIN  (via drill 0.5)
  Top 0.203: 70.41,24.79 R45.1 70.31,24.79
  Top 0.254: v80.87,42.67 81.79,43.59 81.79,46.23 81.58,46.33 81.58,47.45 IC1.2 | v70.31,26.42 70.31,24.79
  Bottom 0.254: v70.31,26.42 70.31,32.51 70.71,32.51 v80.87,42.67
H_LED  (via drill 0.4, 0.5)
  Top 0.254: R75.2 66.24,11.79 | 66.24,11.79 64.14,11.79 T20.2 66.06,11.96 66.24,11.79 | 66.24,11.79 v66.24,12.6 | v47.95,26.01 v47.95,29.67 | v35.76,43.08 35.76,43.48 37.39,45.11 37.53,45.11 IC2.25
  Bottom 0.254: v66.24,12.6 66.24,15.44 65.43,16.26 62.18,16.26 60.96,17.48 60.96,19.1 55.27,24.79 49.17,24.79 v47.95,26.01 | v47.95,29.67 47.95,34.14 46.33,35.76 45.92,35.76 40.23,41.45 37.39,41.45 v35.76,43.08
H_SET  (via drill 0.4, 0.5)
  Top 0.254: R59.1 R58.1 75.63,20.73 v74.37,20.73 | IC2.26 37.11,46.05 v35.76,44.7 | v49.58,29.67 v49.58,26.01
  Bottom 0.254: v35.76,44.7 38.2,42.27 40.64,42.27 46.33,36.58 46.74,36.58 49.58,33.73 v49.58,29.67 | v49.58,26.01 55.68,26.01 58.12,23.57 72.34,23.57 74.37,21.54 v74.37,20.73
H_TRANS  (via drill 0.4, 0.5)
  Top 0.203: IC3.11 69.19,45.82 69.19,42.77 v69.09,42.67
  Top 0.254: 69.11,42.7 v69.09,42.67 | v60.96,28.85 80.87,28.85 85.71,24.02 R52.1
  Bottom 0.254: v69.09,42.67 69.09,36.98 v60.96,28.85
MISO  (via drill 0.4)
  Top 0.203: v24.59,39.12 24.59,40.03 25.7,41.15 IC2.2 | v8.03,39.01 8.03,37.49 7.62,37.08 7.62,35.97 6.3,34.65 6.3,33.73 CONN1.14
  Bottom 0.203: v24.59,39.12 24.49,39.01 v8.03,39.01
MOSI  (via drill 0.4)
  Top 0.203: v23.67,39.83 23.67,40.34 25.09,41.76 IC2.1 | v9.65,39.83 9.65,37.9 8.43,36.68 8.43,35.56 8.03,35.15 8.03,33.22 6.91,32.11 6.3,32.11 6.3,31.19 CONN1.16
  Bottom 0.203: v23.67,39.83 23.27,39.42 10.06,39.42 v9.65,39.83
N$1
  Top 0.508: A_OUT.1 11.88,75.28 12.6,76 23.16,76 24.79,74.37 24.79,68.72 T2.1
N$2
  Top 0.203: IC2.8 28.96,37.8 28.96,37.69 27.43,36.17 27.13,36.17 22.05,31.09 22.05,30.89 21.95,30.89
  Top 0.254: IC2.8 28.91,37.85 | 21.95,30.89 21.44,30.89 | 21.44,30.89 Q1.1 | 21.44,30.89 21.35,30.89 C8.2
N$3
  Top 0.203: 12.19,56.9 R17.2
  Top 0.254: 12.19,56.9 11.89,57.2 T5.B 7.28,56.02 R23.1
N$4
  Top 0.203: C7.2 16.36,34.14 16.26,34.14 | Q1.2 16,30.63
  Top 0.254: IC2.7 28.57,38.32 24.79,34.54 21.54,34.54 20.73,35.36 17.48,35.36 16.26,34.14 16.26,30.89 16,30.63 15.85,30.48
N$5
  Top 0.254: 21.13,57.3 T6.B 16.19,57.2 R18.2 15.85,55.23 R26.1
N$6
  Top 0.508: B_OUT.1 28.85,74.37 27.64,73.15 27.64,67.87 25.78,66.02 T2.3
N$7
  Top 0.203: 32.92,57.2 32.92,56.19 R21.1
  Top 0.254: T7.B 32.92,57.2 34.61,57.2 R19.2
N$8
  Top 0.203: 42.23,56.79 42.27,56.79 T8.B | 40.6,56.79 40.64,56.79 40.64,56.86
  Top 0.254: R20.2 40.64,56.86 42.74,56.86 T8.B | 42.23,56.79 42.23,56.86 42.27,56.9 | R27.1 40.6,56.79 40.6,56.86 40.64,56.9
N$9
  Top 0.508: F_OUT.1 39.99,5.04 38.2,3.25 27.23,3.25 24.38,6.1 24.38,11.26 T19.1
N$10
  Top 0.203: 41.9,22.39 41.96,22.45 T13.B
  Top 0.254: R61.2 36.64,22.45 T13.B 41.86,23.98 41.45,24.38 R47.1 | 41.9,22.39 41.86,22.35
N$11
  Top 0.203: 33.73,22.35 R60.2 | 31.7,22.05 31.7,23.98 R53.1
  Top 0.254: T18.B 31.7,22.05 33.43,22.05 33.73,22.35 33.63,22.45
N$12
  Top 0.508: T19.3 22.58,14.05 21.54,13.01 21.54,6.1 21.23,5.79 | 21.23,5.79 21.13,5.69 | E_OUT.1 21.34,5.69 21.23,5.79
N$13
  Top 0.254: R57.2 18.76,22.8 T12.B 19.06,22.49 R42.1
N$14
  Top 0.203: T11.B 6.15,22.4
  Top 0.254: R56.2 6.54,22.8 6.15,22.4 6.1,22.35 5.69,22.76 5.28,22.76 5.25,22.8 R40.1
N$15
  Top 0.508: C_OUT.1 49.82,74.61 51.61,76.4 61.77,76.4 69.09,69.09 68.99,68.99 T1.1
N$16
  Top 0.203: T9.B 50.84,57.27 | 52.39,57.2 52.43,57.2 52.43,57.27
  Top 0.254: R13.2 52.43,57.27 50.84,57.27 50.8,57.3 | R30.1 52.39,57.2 52.39,57.27 52.43,57.3
N$17
  Top 0.203: 58.93,57.3 R14.2 | 62.18,57.2 62.18,54.46 R34.1
  Top 0.254: T10.B 62.18,57.2 59.03,57.2 58.93,57.3
N$18
  Top 0.508: T1.3 70.08,66.42 71.12,67.46 71.12,71.93 68.83,74.22 | 68.83,74.22 68.68,74.37 | D_OUT.1 68.99,74.37 68.83,74.22
N$19
  Top 0.203: 76.81,57.3 R15.2
  Top 0.254: T3.B 73.15,57.61 | 73.15,57.61 76.5,57.61 76.81,57.3 | R31.1 73.11,57.57 73.15,57.61
N$20
  Top 0.203: 84.43,57.2 T4.B
  Top 0.254: R16.1 84.6,57.27 T4.B | R32.2 83.35,56.12 84.43,57.2 84.94,57.71
N$21
  Top 0.508: H_OUT.1 78.19,5.45 76,3.25 66.65,3.25 64.21,5.69 64.21,10.57 64.01,10.67 T20.1
N$22
  Top 0.254: R59.2 79.18,22.45 T17.B 83.31,23.61 R51.1
N$23
  Top 0.203: 76.1,24.79 R46.1 76,24.79
  Top 0.254: T16.B 75.66,22.45 R58.2 76,24.79
N$24
  Top 0.508: G_OUT.1 59.9,5.85 61.77,7.72 61.77,12.19 62.59,13.01 63.74,13.01 T20.3
N$25
  Top 0.203: 58.52,22.35 R63.2
  Top 0.254: T15.B 58.62,22.45 58.52,22.35 | R50.1 58.97,22.83 R63.2
N$26
  Top 0.203: T14.B 50.43,22.39
  Top 0.254: R62.2 50.43,22.39 | 50.43,22.39 50.39,22.35 | R49.1 51.58,23.53 50.43,22.39
N$27
  Bottom 0.762: F1.1 8.74,42.67 7.62,43.79 6.3,43.79 CONN1.6
N$28
  Top 0.203: 12.19,62.18 12.19,62.28 R9.1 | T5.C 6.1,58.62 5.18,58.62 3.25,56.69 3.25,55.27 R22.2
  Top 0.254: T5.C 7.72,59.74 10.16,62.18 12.19,62.18 | A_OUT.3 16.92,68.53 14.22,65.84 14.22,64.25 R9.1
N$29
  Top 0.203: 34.85,62.18 R11.1
  Top 0.254: B_OUT.3 35.76,62.59 34.95,61.77 34.95,62.18 34.85,62.18 32.92,62.18 30.48,59.74 T7.C 26.42,59.74 25.16,58.48 R24.2
N$30
  Top 0.254: C_OUT.3 54.86,63.84 | 54.86,63.84 R5.1 | 54.86,63.84 54.86,63.8 T9.C 49.58,59.74 48.73,58.89 R29.2
N$31
  Top 0.254: D_OUT.3 73.97,71.93 76.81,69.09 R7.1 76.77,62.59 76,62.59 73.56,60.15 T3.C 70.31,60.15 69.05,58.89 R36.2
N$32
  Top 0.254: F_OUT.3 34.95,15 R69.1 36.61,16.66 37.39,16.66 40.64,19.91 T13.C 42.67,19.91 43.89,21.13 43.89,22.76 43.04,23.61 R48.2
N$33
  Top 0.254: H_OUT.3 78.84,11.38 R67.1 78.88,17.07 80.47,17.07 T17.C 85.34,19.91 87.38,21.95 87.38,23.94 R52.2
N$34
  Top 0.254: 15.04,17.07 15.44,17.07 18.29,19.91 T12.C 21.95,19.91 23.98,21.95 23.98,24.35 R43.2 | 15.04,17.07 13.86,17.07 R65.1 | E_OUT.3 16.26,15.85 15.04,17.07
N$35
  Top 0.203: T15.C 63.4,19.51
  Top 0.254: T15.C 62.99,19.91 59.74,16.66 58.56,16.66 R71.1 54.86,12.97 G_OUT.3 | 63.4,19.51 64.21,19.51 65.43,20.73 65.43,22.76 64.62,23.57 62.99,23.57 62.55,24.02 R44.2
N$50
  Top 0.203: 15.75,62.18 15.84,62.18 | 15.75,65.73 15.75,62.38 15.65,62.28 15.75,62.18 | 15.75,62.18 R10.1 | R25.2 22.55,54.97 22.55,54.86
  Top 0.254: 15.75,65.73 17.88,67.87 17.88,71.12 19.51,72.75 19.51,74.22 A_OUT.4 | 15.84,62.18 17.88,62.18 20.32,59.74 T6.C 21.95,59.74 23.57,58.12 23.57,55.68 22.76,54.86 22.55,54.86 22.35,54.86
N$51
  Top 0.203: 44.7,54.86 R28.2
  Top 0.254: B_OUT.4 38.3,62.32 R12.1 38.24,62.18 39.83,62.18 42.27,59.74 T8.C 43.89,59.74 44.7,58.93 44.7,54.86
N$52
  Top 0.203: 26.01,23.98 R55.2
  Top 0.254: 26.42,19.91 T18.C | F_OUT.4 32.41,15.3 R68.1 30.85,19.51 T18.C | T18.C 26.82,19.51 25.2,21.13 25.2,23.16 26.01,23.98
N$53
  Top 0.203: 6.5,19.91 T11.C | 9.35,24.79 R41.2
  Top 0.254: E_OUT.4 13.72,14.29 R64.1 9.38,17.03 6.5,19.91 5.28,19.91 4.06,21.13 4.06,25.6 4.47,26.01 8.94,26.01 9.35,25.6 9.35,24.79
N$54
  Top 0.203: R33.2 87.48,54.86 87.43,54.91
  Top 0.254: D_OUT.4 76.5,71.83 79.65,68.68 R8.1 82.46,62.62 T4.C 86.97,60.15 87.78,59.33 87.78,55.27 87.43,54.91 87.38,54.86
N$55
  Top 0.203: 64.62,54.46 R35.2
  Top 0.254: C_OUT.4 57.4,64.15 R6.1 58.97,62.59 60.15,62.59 62.99,59.74 T10.C 64.62,59.74 66.24,58.12 66.24,57.3 64.62,55.68 64.62,54.46
N$56
  Top 0.203: H_OUT.4 70.71,5.69 | 68.68,24.79 R45.2
  Top 0.254: 76,16.66 R66.1 76,17.07 | 76,16.66 76,10.97 70.71,5.69 | 76,16.66 75.59,17.07 74.78,17.07 71.93,19.91 T16.C 69.49,19.91 68.68,20.73 68.68,24.79
N$60
  Top 0.203: 46.74,23.98 R54.2
  Top 0.254: G_OUT.4 52.32,13.27 R70.1 55.64,16.66 54.05,16.66 50.8,19.91 T14.C 47.95,19.91 46.74,21.13 46.74,23.98
RX0  (via drill 0.4, 0.5)
  Top 0.203: IC1.14 78.23,40.34 78.23,40.23
  Top 0.254: IC2.9 29.56,37.28 v27.64,35.36 | v36.98,31.7 71.53,31.7 78.23,38.41 78.23,40.23 | IC1.11 IC1.12 IC1.13 IC1.14
  Bottom 0.254: v27.64,35.36 27.64,34.95 28.45,34.14 29.26,34.14 30.89,32.51 36.17,32.51 v36.98,31.7
RX1
  Top 0.203: IC1.15 78.84,40.34 78.84,40.23
  Top 0.254: IC2.11 31.31,36.15 36.98,30.48 72.34,30.48 78.84,36.98 78.84,40.23 | IC1.15 IC1.16 IC1.17 IC1.18
SCK  (via drill 0.4)
  Top 0.203: v24.89,42.88 25.6,42.88 26.82,41.66 26.82,41.25 26.31,40.74 IC2.3 | v11.07,40.64 10.46,40.03 10.46,39.52 10.06,39.12 10.06,37.69 8.84,36.47 8.84,35.36 8.43,34.95 8.43,33.02 7.62,32.21 7.62,30.89 6.5,29.77 3.35,29.77 3.35,29.97 2.64,30.68 2.64,31.6 3.76,32.72 3.76,33.63 CONN1.13
  Bottom 0.203: v24.89,42.88 23.06,41.05 22.25,41.05 21.44,40.23 11.48,40.23 v11.07,40.64
TCK  (via drill 0.4)
  Top 0.203: v35.76,41.55 35.76,41.76 37.8,41.76 38.3,41.25 38.41,41.25 IC2.21 | v33.43,47.95 v33.43,42.88 | v54.66,45.92 54.15,45.92 53.44,45.21 53.44,39.83 53.14,39.52 53.14,37.9 52.12,36.88 52.12,35.97 JP1.1
  Bottom 0.203: v35.76,41.55 34.75,41.55 v33.43,42.88 | v33.43,47.95 43.89,47.95 45.41,49.48 51.1,49.48 v54.66,45.92
TDI  (via drill 0.4)
  Top 0.203: v40.23,45.41 38.91,45.41 38.51,45.01 IC2.24
  Bottom 0.203: v40.23,45.41 44.5,45.41 47.14,48.06 50.09,48.06 51.61,46.53 51.61,46.13 JP1.9
TDO  (via drill 0.4)
  Top 0.203: v40.23,44.2 40.13,44.2 39.62,44.7 39.42,44.7 39.12,44.4 IC2.23 | v44.2,44.2 44.3,44.09 44.3,42.98 48.46,38.81 48.46,38 49.07,37.39 49.99,37.39 50.09,37.49 52.12,37.49 52.12,38.51 JP1.3
  Bottom 0.203: v44.2,44.2 v40.23,44.2
TMS  (via drill 0.4)
  Top 0.203: v39.42,43.38 39.42,41.76 39.12,41.76 IC2.22
  Bottom 0.203: v39.42,43.38 47.35,43.38 48.16,42.57 48.97,42.57 49.07,42.47 49.99,42.47 50.19,42.67 50.39,42.67 51.61,41.45 51.61,41.05 JP1.5
TRANS_STANDBY  (via drill 0.4)
  Top 0.203: R37.2 86.97,43.08 85.55,43.08 85.55,41.66 82.8,38.91 81.89,38.91 81.89,39.12 81.48,39.52 81.48,40.23 IC1.19 81.38,40.23 81.38,41.55 81.43,41.6 | 81.43,41.6 81.69,41.86 81.69,42.57 82.4,43.38 82.4,46.63 82.19,46.84 82.19,47.04 82.14,47.09 | 63.3,39.01 63.3,38.71 IC3.1 | R38.2 58.12,42.98 57,42.98 57,40.95 57.05,40.89 57,40.84 57,33.83 | v34.14,40.13 33.43,39.42 33.43,37.19 33.83,36.78 33.93,36.78 IC2.13 | v39.93,40.64 40.03,40.54 40.03,40.34 43.79,36.58 48.16,36.58 48.16,34.75 49.07,33.83 57,33.83 | 63.3,39.01 63.3,41.66 | 63.3,41.66 63.3,43.89 64.11,44.7 64.11,45.72 64.01,45.82 IC3.19 | 63.3,39.01 IC3.1 | 63.3,41.66 81.38,41.66 81.43,41.6 | 57,33.83 59.54,33.83 63.2,37.49 63.2,37.9 63.3,38 63.3,38.61 IC3.1 | 82.14,47.09 82.09,47.14 | IC1.1 82.19,47.45 82.19,47.14 82.14,47.09
  Bottom 0.203: v34.14,40.13 39.42,40.13 v39.93,40.64
TX0  (via drill 0.4, 0.5)
  Top 0.203: 64.21,38.71 64.21,38.64 64.21,38.61
  Top 0.254: v37.8,33.33 59.74,33.33 64.01,37.59 64.01,38.41 64.21,38.61 | v29.26,35.36 29.26,35.71 IC2.10 | IC3.5 IC3.4 IC3.3 64.21,38.64 IC3.2
  Bottom 0.254: v37.8,33.33 30.89,33.33 29.67,34.54 29.67,34.95 v29.26,35.36
TX1
  Top 0.254: IC2.12 34.14,35.39 34.14,35.36 36.98,32.51 60.15,32.51 65.02,37.39 66.65,37.39 66.65,38.56 IC3.6 IC3.7 IC3.8 IC3.9
VCC  (via drill 0.4)
  Top 0.203: 30.02,42.11 30.07,42.16 30.07,46.33 28.65,47.75 IC2.38 28.55,47.65 27.53,48.67 27.53,48.97 27.03,49.48 23.67,49.48 23.57,49.58 C1.1 | 30.02,42.11 27.53,39.62 IC2.5 | 35.2,46.58 35.97,45.82 36.68,46.53 IC2.27 36.78,46.63 37.69,47.55 39.01,47.55 C2.1 39.01,46.43 41.35,46.43 41.96,45.82 41.96,45.11 L1.2 41.96,45.92 v41.96,48.77 | 35.2,46.58 35.15,46.63 35.15,47.24 35.56,47.65 IC2.29 | 35.2,46.58 34.95,46.33 34.95,42.06 | 34.95,42.06 34.95,40.13 36.17,38.91 IC2.17 36.27,39.01 36.98,38.3 36.98,35.76 37.9,35.76 38,35.66 C6.1 | 34.95,42.06 30.07,42.06 30.02,42.11 | 82.19,40.34 IC1.20 82.19,40.44 82.19,41.66 82.5,41.96 83.21,41.96 | R37.1 86.97,44.7 85.65,44.7 85.55,44.6 85.55,43.59 84.63,43.59 84.53,43.48 C4.2 84.53,41.96 83.21,41.96 | 63.4,45.92 IC3.20 | R38.1 58.12,41.35 59.94,41.35 59.94,41.96 60.55,42.57 60.96,42.57 C5.2 60.96,44.09 62.89,44.09 63.3,44.5 63.3,45.82 IC3.20 | 83.21,41.96 83.21,47.14 v83.11,47.24 | v63.3,47.35 63.3,45.92 IC3.20
  Bottom 0.203: v83.11,47.24 78.03,47.24 77.32,46.53 64.11,46.53 v63.3,47.35 62.18,47.35 60.86,48.67 52.53,48.67 51.31,49.89 45.21,49.89 44.3,48.97 42.16,48.97 v41.96,48.77

### Text on the board
tNames: D48245 | module_SensorControl | https://github.com/sosoru/TrainUtilizingSystem